# EAGLE schematic E_KEYPAD__2_1 (EAGLE 6.4)
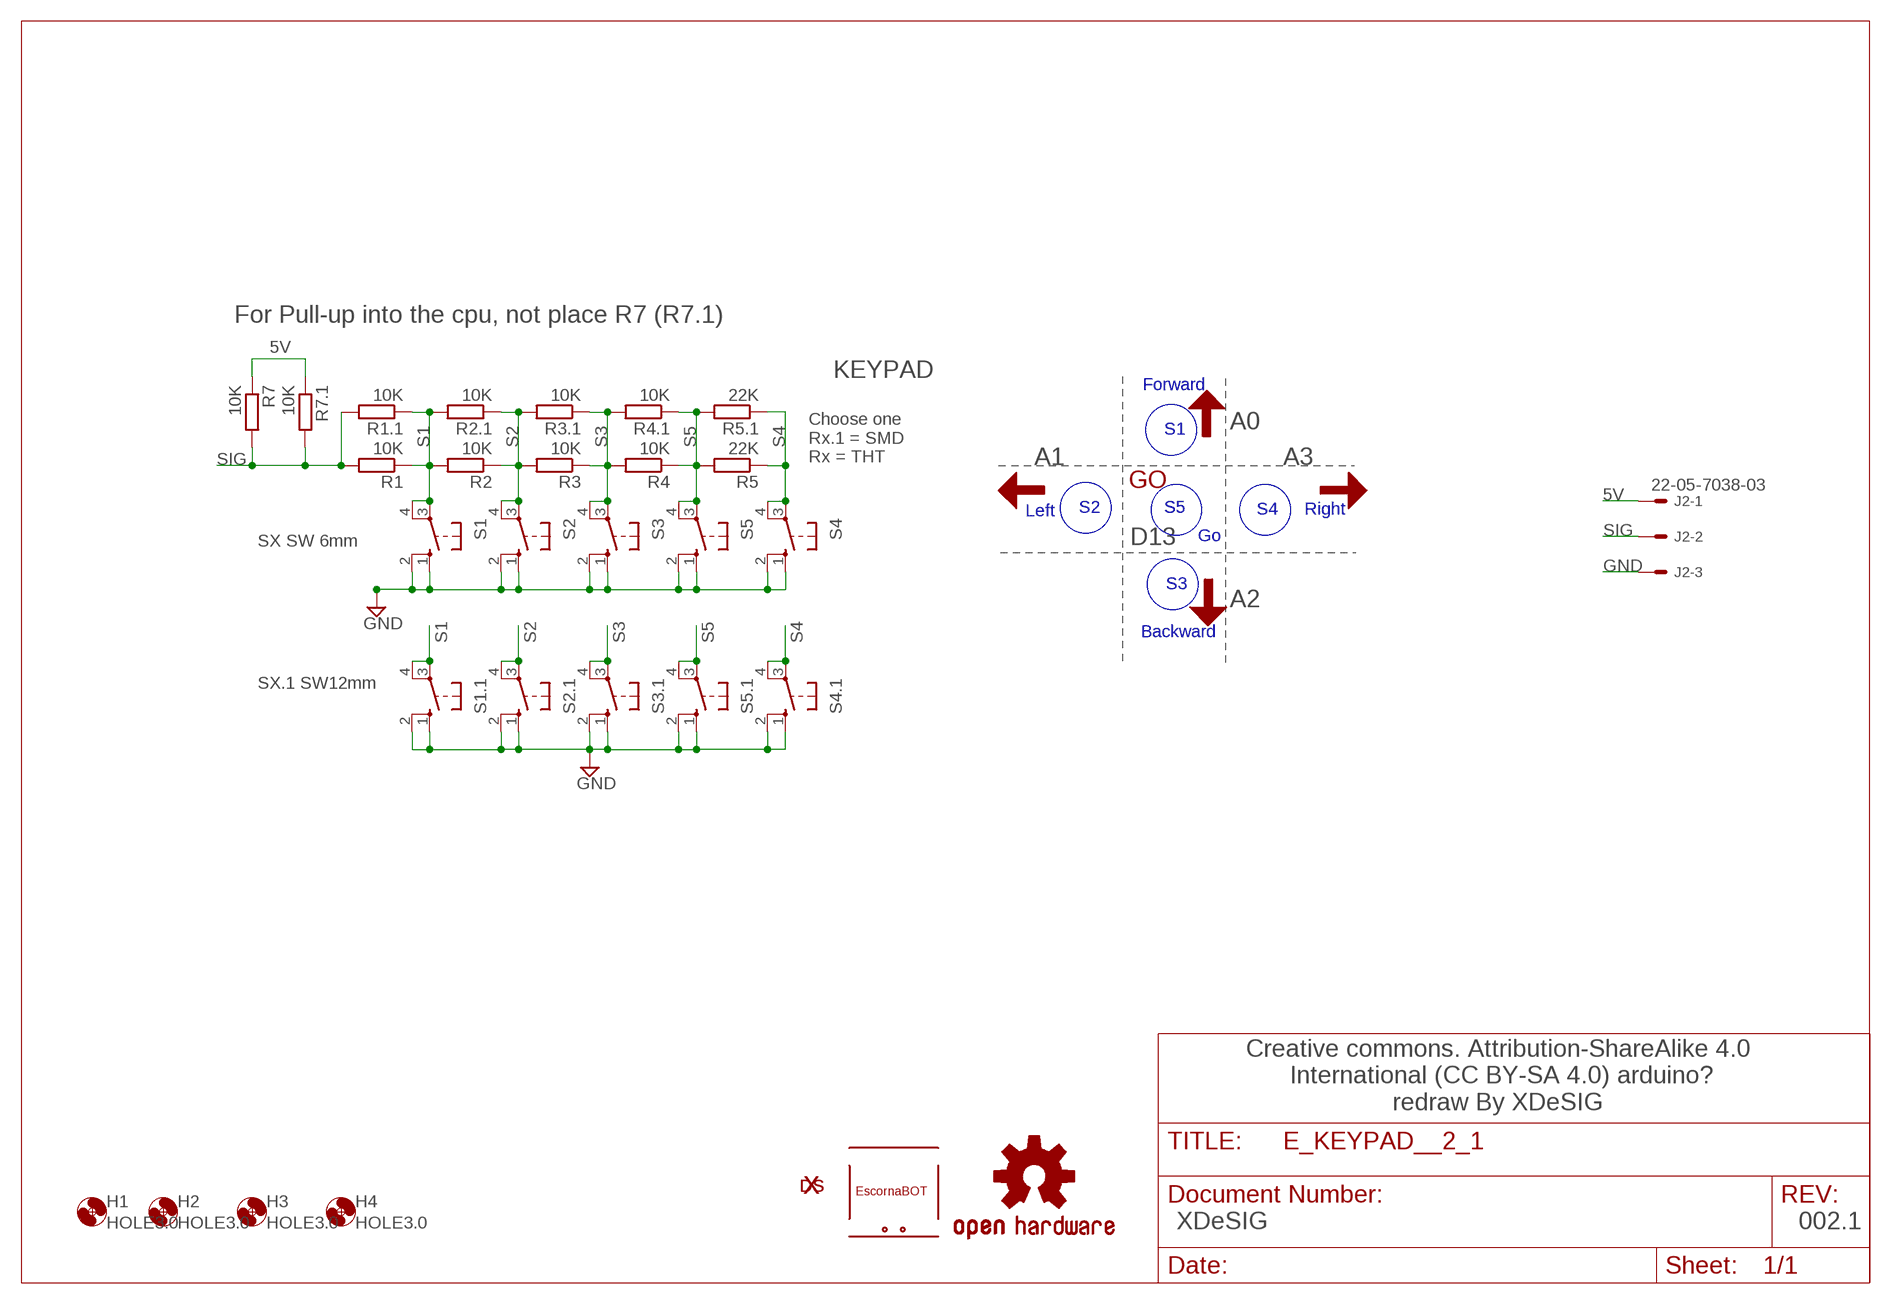
[diagram p0: schematic, sheet 1]

## Parts
H1  HOLE3.0  MOUNT-HOLE3.0  [3,0]
H2  HOLE3.0  MOUNT-HOLE3.0  [3,0]
H3  HOLE3.0  MOUNT-HOLE3.0  [3,0]
H4  HOLE3.0  MOUNT-HOLE3.0  [3,0]
J2  22-05-7038-03  [7395-03]
LOGO2  OSHW-LOGOS  [OSHW-LOGO-S]
R1  10K  R-EU_0204/7  [0204/7]
R1.1  10K  R-EU_R0603  [R0603]
R2  10K  R-EU_0204/7  [0204/7]
R2.1  10K  R-EU_R0603  [R0603]
R3  10K  R-EU_0204/7  [0204/7]
R3.1  10K  R-EU_R0603  [R0603]
R4  10K  R-EU_0204/7  [0204/7]
R4.1  10K  R-EU_R0603  [R0603]
R5  22K  R-EU_0204/7  [0204/7]
R5.1  22K  R-EU_R0603  [R0603]
R7  10K  R-EU_0204/7  [0204/7]
R7.1  10K  R-EU_R0603  [R0603]
S1  10-XX  [B3F-10XX]
S1.1  40-XX  [B3F-40XX]
S2  10-XX  [B3F-10XX]
S2.1  40-XX  [B3F-40XX]
S3  10-XX  [B3F-10XX]
S3.1  40-XX  [B3F-40XX]
S4  10-XX  [B3F-10XX]
S4.1  40-XX  [B3F-40XX]
S5  10-XX  [B3F-10XX]
S5.1  40-XX  [B3F-40XX]
U$1  ESCORNABOT  [ESCORNA_PEQUE]
U$3  FRECHA  [FRECHA]
U$4  FRECHA  [FRECHA]
U$5  GO  [VALE]
U$6  FRECHA  [FRECHA]
U$7  XDESIG21  [XDESIG]
U$8  XDESIG  [XDESIG_CU_2]
U$11  FRECHA  [FRECHA]

## Nets
5V: J2.1 R7.1 R7.1.1
GND: J2.3 S1.1(S) S1.1.1(S) S1.1.2(S1) S1.2(S1) S2.1(S) S2.1.1(S) S2.1.2(S1) S2.2(S1) S3.1(S) S3.1.1(S) S3.1.2(S1) S3.2(S1) S4.1(S) S4.1.1(S) S4.1.2(S1) S4.2(S1) S5.1(S) S5.1.1(S) S5.1.2(S1) S5.2(S1)
S1: R1.1 R1.1.1 R2.1.2 R2.2 S1.1.3(P) S1.1.4(P1) S1.3(P) S1.4(P1)
S2: R2.1 R2.1.1 R3.1.2 R3.2 S2.1.3(P) S2.1.4(P1) S2.3(P) S2.4(P1)
S3: R3.1 R3.1.1 R4.1.2 R4.2 S3.1.3(P) S3.1.4(P1) S3.3(P) S3.4(P1)
S4: R5.1 R5.1.1 S4.1.3(P) S4.1.4(P1) S4.3(P) S4.4(P1)
S5: R4.1 R4.1.1 R5.1.2 R5.2 S5.1.3(P) S5.1.4(P1) S5.3(P) S5.4(P1)
SIG: J2.2 R1.1.2 R1.2 R7.1.2 R7.2

## Notes on the sheet
- For Pull-up into the cpu, not place R7 (R7.1)
- KEYPAD
- Forward
- A0
- S1
- A1 | A3
- Choose one
  Rx.1 = SMD
  Rx = THT
- Left | S2 | S5 | S4 | Right
- D13 | Go
- SX SW 6mm
- S3
- A2
- Backward
- SX.1 SW12mm
- Creative commons. Attribution-ShareAlike 4.0
   International (CC BY-SA 4.0) arduino?
  redraw By XDeSIG
- XDeSIG | 002.1

## Library data of the parts
H1-H4 = holes:MOUNT-HOLE: MOUNTING HOLE with drill center marker
J2 = con-molex:22-?-03: CONNECTOR wire to board 2.54 mm (.1 inch) pitch header; OC_FARNELL: unknown; OC_NEWARK: unknown
LOGO2 = SparkFun-Aesthetics:OSHW-LOGO: Open Source Hardware Logo This logo indicates the piece of hardware it is found on incorporates a OSHW license and/or adheres to the definition of open source hardware found here: http://freedomdefined.org/OSHW
R1 R1.1 R2 R2.1 R3 R3.1 R4 R4.1 R5 R5.1 R7 R7.1 = rcl:R-EU_: RESISTOR, European symbol
S1-S5 = switch-omron:10-XX: OMRON SWITCH; MPN: B3F-1000; OC_FARNELL: 176432; OC_NEWARK: 36M3542
S1.1 S2.1 S3.1 S4.1 S5.1 = switch-omron:40-XX: OMRON SWITCH; MF: OMRON COMPONENTS USA; MPN: B3F-4000; OC_FARNELL: 176434; OC_NEWARK: 36K3105
U$1 = escorna:ESCORNABOT
U$3 U$4 U$6 U$11 = escorna:FRECHA
U$5 = escorna:GO
U$7 U$8 = xdesig:XDESIG

## Net classes
0 default: clearance 0.355 mm